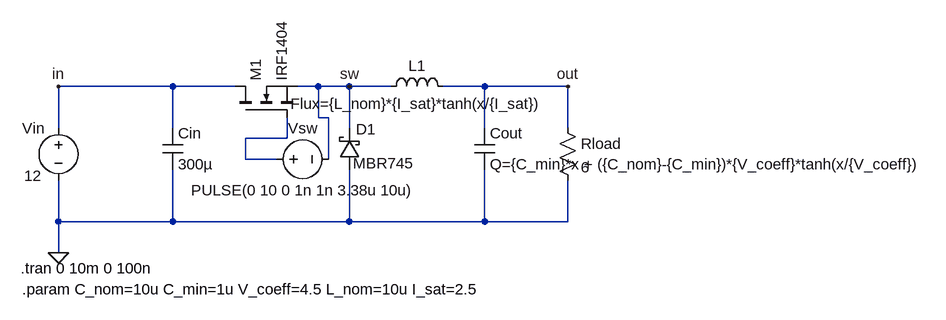
[diagram p0: schematic Buck_converter_real.asc]
Buck_converter_real.asc, the LTspice schematic file:
Version 4
SHEET 1 1356 680
WIRE 64 128 -112 128
WIRE 160 128 64 128
WIRE 288 128 256 128
WIRE 336 128 288 128
WIRE 400 128 336 128
WIRE 544 128 480 128
WIRE 672 128 544 128
WIRE 288 176 288 128
WIRE 304 176 288 176
WIRE -112 192 -112 128
WIRE 64 192 64 128
WIRE 336 192 336 128
WIRE 544 192 544 128
WIRE 672 192 672 128
WIRE 240 208 240 176
WIRE 240 208 176 208
WIRE 176 240 176 208
WIRE 224 240 176 240
WIRE 304 240 304 176
WIRE -112 336 -112 272
WIRE 64 336 64 256
WIRE 64 336 -112 336
WIRE 336 336 336 256
WIRE 336 336 64 336
WIRE 544 336 544 256
WIRE 544 336 336 336
WIRE 672 336 672 272
WIRE 672 336 544 336
WIRE -112 384 -112 336
FLAG -112 384 0
FLAG 336 128 sw
FLAG -112 128 in
FLAG 672 128 out
SYMBOL voltage -112 176 R0
WINDOW 0 -56 16 Left 2
WINDOW 3 -53 89 Left 2
WINDOW 123 0 0 Left 0
WINDOW 39 0 0 Left 0
SYMATTR InstName Vin
SYMATTR Value 12
SYMBOL cap 48 192 R0
SYMATTR InstName Cin
SYMATTR Value 300µ
SYMBOL schottky 352 256 R180
WINDOW 0 -25 62 Left 2
WINDOW 3 -83 10 Left 2
SYMATTR InstName D1
SYMATTR Value MBR745
SYMATTR Description Diode
SYMATTR Type diode
SYMBOL ind 384 144 R270
WINDOW 0 32 56 VTop 2
WINDOW 3 5 56 VBottom 2
SYMATTR InstName L1
SYMATTR Value Flux={L_nom}*{I_sat}*tanh(x/{I_sat})
SYMBOL nmos 160 176 R270
SYMATTR InstName M1
SYMATTR Value IRF1404
SYMBOL res 656 176 R0
SYMATTR InstName Rload
SYMATTR Value 6
SYMBOL voltage 208 240 R270
WINDOW 0 32 56 VTop 2
WINDOW 3 -32 56 VBottom 2
WINDOW 123 0 0 Left 0
WINDOW 39 0 0 Left 0
SYMATTR InstName Vsw
SYMATTR Value PULSE(0 10 0 1n 1n 3.38u 10u)
SYMBOL cap 528 192 R0
SYMATTR InstName Cout
SYMATTR Value Q={C_min}*x + ({C_nom}-{C_min})*{V_coeff}*tanh(x/{V_coeff})
TEXT -170 408 Left 2 !.tran 0 10m 0 100n
TEXT -168 440 Left 2 !.param C_nom=10u C_min=1u V_coeff=4.5 L_nom=10u I_sat=2.5

The netlist it stands for:
* Buck_converter_real.asc
Vin in 0 12
Cin in 0 300µ
D1 0 sw MBR745
L1 sw out Flux={L_nom}*{I_sat}*tanh(x/{I_sat})
M1 in N001 sw sw IRF1404
Rload out 0 6
Vsw N001 sw PULSE(0 10 0 1n 1n 3.38u 10u)
Cout out 0 Q={C_min}*x + ({C_nom}-{C_min})*{V_coeff}*tanh(x/{V_coeff})
.model D D
.lib standard.dio
.model NMOS NMOS
.model PMOS PMOS
.lib standard.mos
.tran 0 10m 0 100n
.param C_nom=10u C_min=1u V_coeff=4.5 L_nom=10u I_sat=2.5
.backanno
.end